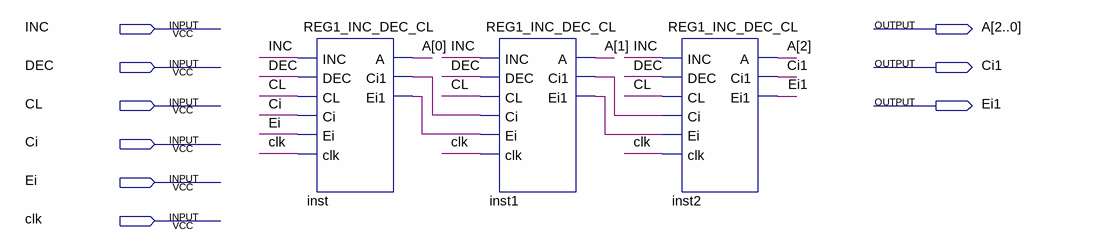
[diagram p0: schematic sheet]
// Quartus schematic REG3_INC_DEC_CL.bdf as structural Verilog: 3 symbols, 9 pins
module REG3_INC_DEC_CL (
  input  INC,
  input  DEC,
  input  CL,
  input  Ci,
  input  Ei,
  input  clk,
  output [2:0] A,
  output Ci1,
  output Ei1
);

  wire inst1_ci1, inst1_ei1, inst_ci1, inst_ei1;

  REG1_INC_DEC_CL inst (
    .INC(INC), .DEC(DEC), .CL(CL), .Ci(Ci), .Ei(Ei), .clk(clk), .A(A[0]), .Ci1(inst_ci1), .Ei1(inst_ei1));
  REG1_INC_DEC_CL inst1 (
    .INC(INC), .DEC(DEC), .CL(CL), .Ci(inst_ci1), .Ei(inst_ei1), .clk(clk), .A(A[1]), .Ci1(inst1_ci1),
    .Ei1(inst1_ei1));
  REG1_INC_DEC_CL inst2 (
    .INC(INC), .DEC(DEC), .CL(CL), .Ci(inst1_ci1), .Ei(inst1_ei1), .clk(clk), .A(A[2]), .Ci1(Ci1), .Ei1(Ei1));
endmodule
